# EAGLE design button (EAGLE 6.4)
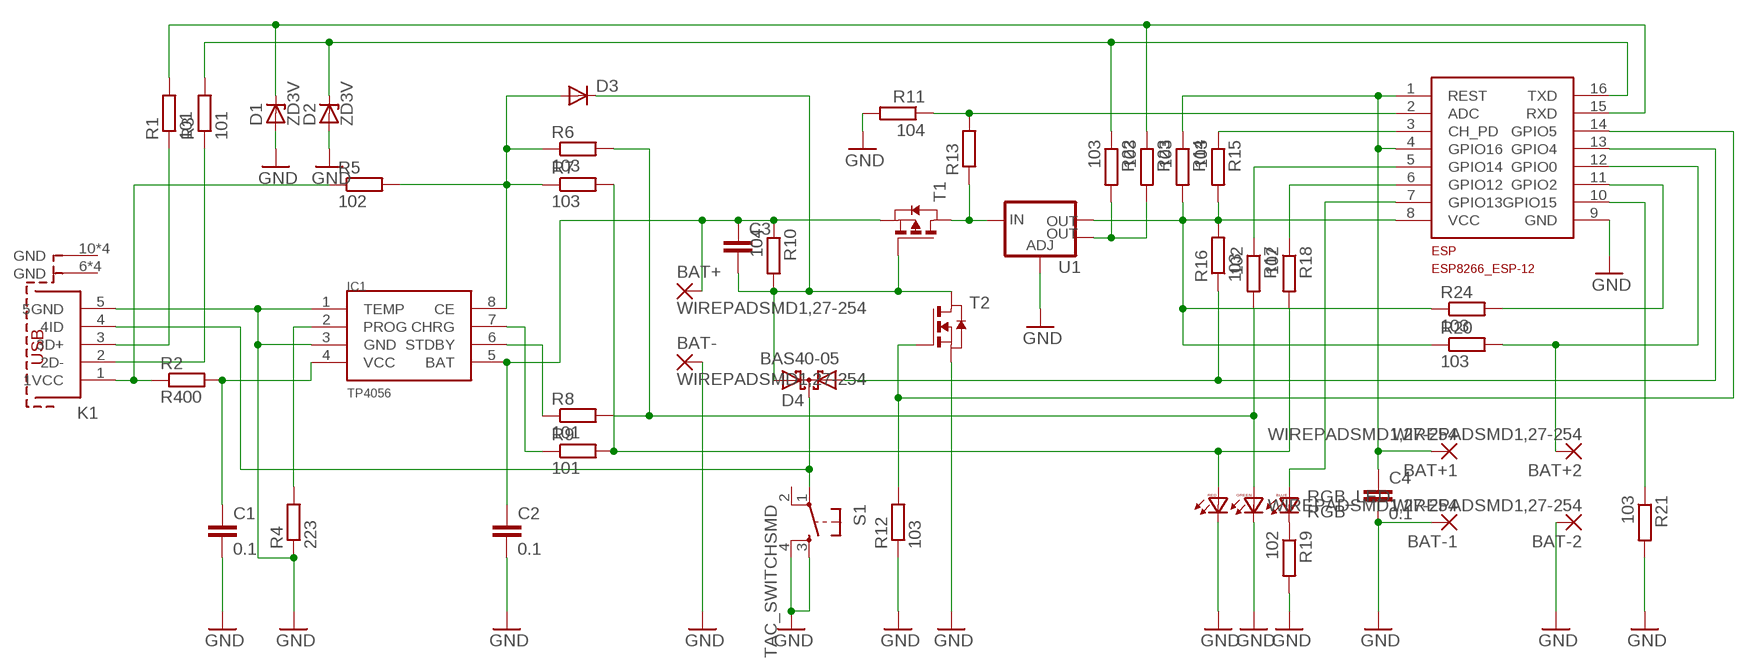
[diagram p0: schematic, sheet 1]

## Parts
BAT+  WIREPADSMD1,27-254  [SMD1,27-2,54]
BAT+1  WIREPADSMD1,27-254  [SMD1,27-2,54]
BAT+2  WIREPADSMD1,27-254  [SMD1,27-2,54]
BAT-  WIREPADSMD1,27-254  [SMD1,27-2,54]
BAT-1  WIREPADSMD1,27-254  [SMD1,27-2,54]
BAT-2  WIREPADSMD1,27-254  [SMD1,27-2,54]
C1  0.1  C-EUC1206K  [C1206K]
C2  0.1  C-EUC1206K  [C1206K]
C3  C-EUC1206K  [C1206K]
C4  0.1  C-EUC1206K  [C1206K]
D1  ZD3V  [SOD123]
D2  ZD3V  [SOD123]
D3  DIODE-SOD123  [SOD123]
D4  BAS40-05  [SOT23]
ESP  ESP8266_ESP-12GPIO04/05_CORRECTED  [ESP8266-ESP12]
IC1  TP4056  [SOP-8]
K1  629105150921  [629105150921]
R1  101  R-EU_R0603  [R0603]
R2  R400  R-EU_R1206  [R1206]
R3  101  R-EU_R0603  [R0603]
R4  223  R-EU_R0603  [R0603]
R5  102  R-EU_R0603  [R0603]
R6  103  R-EU_R0603  [R0603]
R7  103  R-EU_R0603  [R0603]
R8  101  R-EU_R0603  [R0603]
R9  101  R-EU_R0603  [R0603]
R10  104  R-EU_R0603  [R0603]
R11  104  R-EU_R0603  [R0603]
R12  103  R-EU_R0603  [R0603]
R13  R-EU_R0603  [R0603]
R14  103  R-EU_R0603  [R0603]
R15  103  R-EU_R0603  [R0603]
R16  103  R-EU_R0603  [R0603]
R17  102  R-EU_R0603  [R0603]
R18  102  R-EU_R0603  [R0603]
R19  102  R-EU_R0603  [R0603]
R20  103  R-EU_R0603  [R0603]
R21  103  R-EU_R0603  [R0603]
R22  103  R-EU_R0603  [R0603]
R23  103  R-EU_R0603  [R0603]
R24  103  R-EU_R0603  [R0603]
RGB_LED  RGB  [RGB]
S1  TAC_SWITCHSMD  [TACTILE-SWITCH-SMD]
T1  PMOSSOT23  [SOT-23]
T2  NMOSSOT23  [SOT-23]
U1  V_REG_LM1117SOT223  [SOT223]

## Nets
GND: BAT-1.1(P) BAT-2.1(P) BAT-.1(P) C1.2 C2.2 C4.2 D1.A D2.A ESP.9(GND) IC1.1(TEMP) IC1.3(GND) K1.5(5GND) R4.1 R11.2 R12.1 R19.2 R21.2 RGB_LED.5(RC) RGB_LED.6(GC) S1.3 S1.4 T2.2(S) U1.1(ADJ)
N$1: R13.1 T1.1(D) U1.3(IN)
N$2: C3.2 D3.C D4.2(A2) R10.2 T1.3(G) T2.1(D)
N$3: D4.1(A1) ESP.13(GPIO4) R16.1
N$4: BAT+.1(P) C2.1 C3.1 IC1.5(BAT) R10.1 T1.2(S)
N$5: ESP.14(GPIO5) R12.2 T2.3(G)
N$6: ESP.3(CH_PD) R15.1
N$7: BAT+1.1(P) C4.1 ESP.1(REST) ESP.4(GPIO16) R14.1
N$8: ESP.7(GPIO13) RGB_LED.3(BA)
N$9: R19.1 RGB_LED.4(BC)
N$10: BAT+2.1(P) ESP.12(GPIO0) R20.2
N$11: ESP.10(GPIO15) R21.1
N$12: ESP.8(VCC) R14.2 R15.2 R16.2 R20.1 R24.1 U1.2(OUT)
N$13: D4.3(C) K1.4(4ID) S1.1
N$14: ESP.6(GPIO12) R18.1
N$15: ESP.2(ADC) R11.1 R13.2
N$17: ESP.11(GPIO2) R24.2
N$18: ESP.5(GPIO14) R17.1
N$19: IC1.6(STDBY) R8.1
N$20: IC1.2(PROG) R4.2
N$21: C1.1 IC1.4(VCC) R2.2
N$22: K1.1(1VCC) R2.1 R5.1
N$23: IC1.7(CHRG) R9.1
N$25: K1.3(3D+) R1.1
N$26: K1.2(2D-) R3.1
N$27: D1.C ESP.15(RXD) R1.2 R23.1
N$28: D2.C ESP.16(TXD) R3.2 R22.1
N$29: R22.2 R23.2 U1.4(OUT)
N$30: R7.2 R9.2 R18.2 RGB_LED.2(RA)
N$31: R6.2 R8.2 R17.2 RGB_LED.1(GA)
N$32: D3.A IC1.8(CE) R5.2 R6.1 R7.1
Unconnected: K1.6(GND) K1.7(GND) K1.8(GND) K1.9(GND) K1.10(GND) K1.11(GND) K1.12(GND) K1.13(GND) S1.2

## Library data of the parts
BAT+ BAT+1 BAT+2 BAT- BAT-1 BAT-2 = wirepad:WIREPAD: Wire PAD connect wire on PCB
C1-C4 = resistor:C-EU: CAPACITOR, European symbol
D1 D2 = diode:ZD3V
D3 = diode:DIODE-: DIODE
D4 = diode:BAS40-05: Silicon Schottky Diodes General-purpose diode for high-speed switching
ESP = ESP8266-ESP12:ESP8266_ESP-12: Espressif ESP8266 ESP-12 Module with GPIO04 and GPIO05 corrected.
IC1 = TP4056:TP4056
K1 = Input-Output_Connectors_rev15d:629105150921: WR-COM_USB_Micro Type AB_Horizontal_SMT ; Micro Type AB Horizontal SMT - with Pegs - T&R Packaging Code : Con_I-O_COM_USB_2.0_AB_629105150921_629105150921 <http://katalog.we-online.de/media/images/eican/Con_I-O_COM_USB_2.0_AB_629105150921_pf2.jpg> Details see: http://katalog.we-online.de/em/datasheet/629105150921.pdf Created 12/08/2014, Dan Xu 2014 (C) Wurth Elektronik
R1-R24 = resistor:R-EU_: RESISTOR, European symbol
RGB_LED = led:RGB
S1 = SparkFun-Retired:TAC_SWITCH: Momentary Switch Button commonly used for reset or general input. Spark Fun Electronics SKU : COM-00097 SMT- SWCH-08247; PROD_ID: SWCH-08247
T1 = zetex:PMOSSOT23: MOS FET; OC_FARNELL: unknown; OC_NEWARK: unknown
T2 = zetex:NMOSSOT23: MOS FET; OC_FARNELL: unknown; OC_NEWARK: unknown
U1 = SparkFun-PowerIC:V_REG_LM1117: Voltage Regulator LM1117 Standard adjustable voltage regulator but in SMD form. Spark Fun Electronics SKU : COM-00595; PROD_ID: VREG-08170

## Board
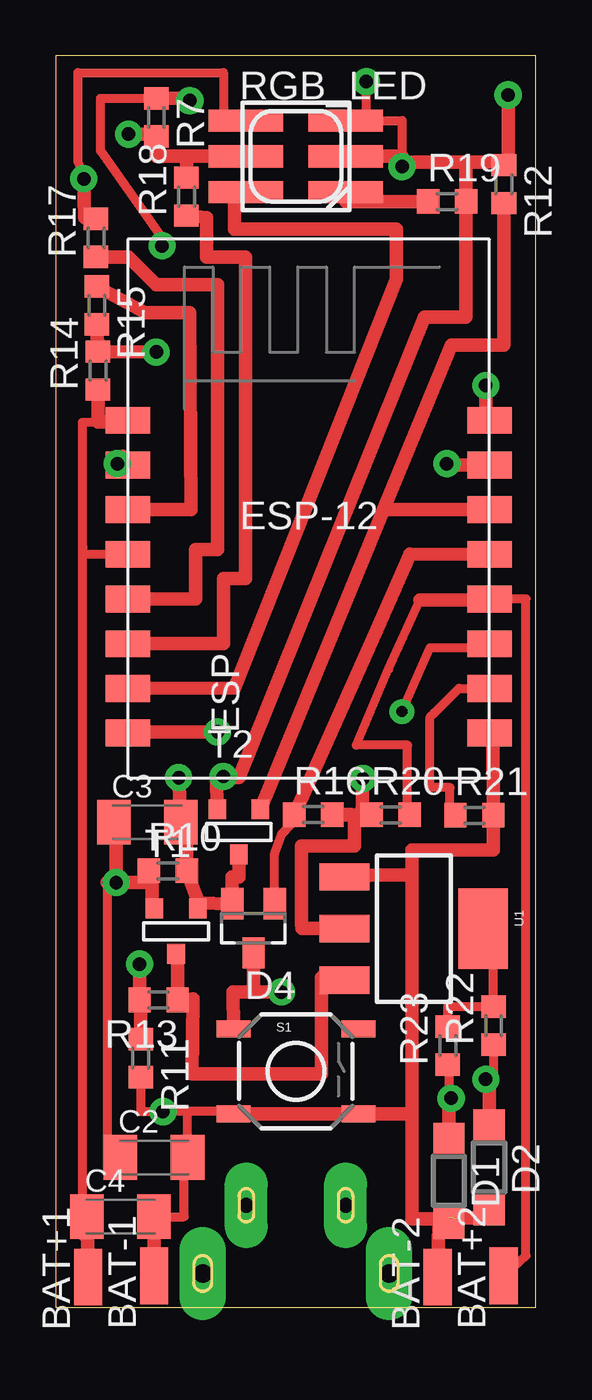
[diagram p1: board, top side]
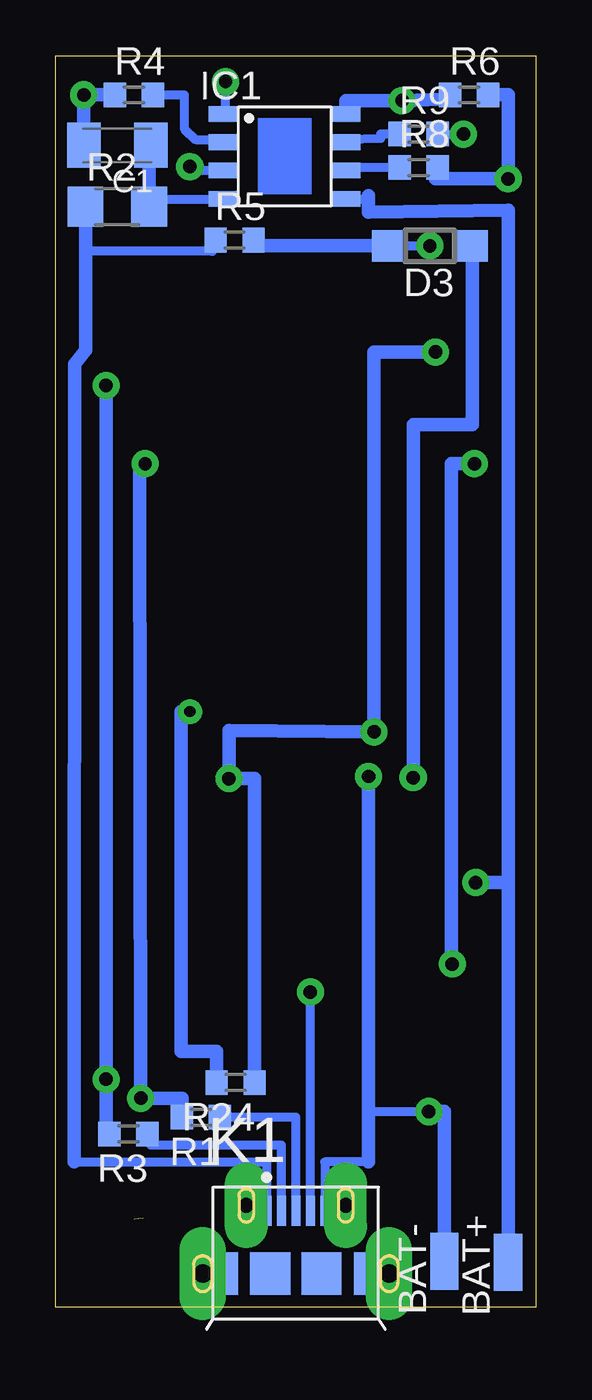
[diagram p2: board, bottom side, seen from below]

Size 21.5 x 56 mm. Coordinates in mm from the lower left corner, seen from the top.
Outline: 0,0 21.5,0 21.5,56 0,56 0,0
Copper layers (1*16): Top 0.035mm / dielectric 1.5mm / Bottom 0.035mm
Design rules "default": minimum track width 10mil, minimum drill 32mil, track to track 16mil, track to pad 16mil, pad to pad 16mil, via to via 16mil, smd to smd 16mil, copper to edge 40mil, drill to drill 40mil, minimum pad ring 25mil, minimum via ring 12mil, stop-mask expansion 4mil, vias tented up to drill 0mil, thermal gap 10mil

### Footprints (pad centres in the part's own frame; a part is rotated, then mirrored left to right if it is on the bottom)
SMD1,27-2,54 = smd 1.27 x 2.54: 1 0,0
C1206K = smd 1.5 x 2: 1 -1.5,0; 2 1.5,0
SOD123 = smd 1.4 x 1.4: A 1.9,0; C -1.9,0
SOT23 = smd 1 x 1.4: 1 -0.95,-1.1; 2 0.95,-1.1; 3 0,1.1
ESP8266-ESP12 = smd 2 x 1.2: 1 0,16; 2 0,14; 3 0,12; 4 0,10; 5 0,8; 6 0,6; 7 0,4; 8 0,2; 9 16.2,2; 10 16.2,4; 11 16.2,6; 12 16.2,8; 13 16.2,10; 14 16.2,12; 15 16.2,14; 16 16.2,16
SOP-8 = smd 1.3 x 0.7: 1 -2.75,1.905; 2 -2.75,0.635; 3 -2.75,-0.635; 4 -2.75,-1.905; 5 2.75,-1.905; 6 2.75,-0.635; 7 2.75,0.635; 8 2.75,1.905
629105150921 = smd 0.4 x 1.35: 1 -1.3,2.805; 2 -0.65,2.805; 3 0,2.805; 4 0.65,2.805; 5 1.3,2.805 | drill 0.65 pad 1 long: 6 -2.225,3.055; 7 2.225,3.055 | drill 0.82 pad 1.1 long: 8 -4.175,0; 9 4.175,0 | smd 2.185 x 1.9: 10 3.692,0; 13 -3.692,0 | smd 1.8 x 1.9: 11 1.15,0; 12 -1.15,0
R0603 = smd 1 x 1.1: 1 -0.85,0; 2 0.85,0
R1206 = smd 1.6 x 1.803: 1 -1.422,0; 2 1.422,0
RGB = smd 3.332 x 1: 1 -2.234,1.6; 2 -2.234,0; 3 -2.234,-1.6; 4 2.234,-1.6; 5 2.234,0; 6 2.234,1.6
TACTILE-SWITCH-SMD = smd 1.524 x 0.762: 1 -2.794,1.905; 2 2.794,1.905; 3 -2.794,-1.905; 4 2.794,-1.905
SOT-23 = smd 0.787 x 0.889: 1 0.025,-1.016; 2 -0.94,1.016; 3 0.991,1.016
SOT223 = smd 1.219 x 2.235: 1 -2.311,-3.099; 2 0,-3.099; 3 2.311,-3.099 | smd 3.6 x 2.2: 4 0,3.099

### Placement (x,y rotation side)
BAT+  1.25,2 0 bottom
BAT+1  1.45,1.35 0 top
BAT+2  20.05,1.4 0 top
BAT-  4.1,2.05 0 bottom
BAT-1  4.4,1.4 0 top
BAT-2  17.1,1.35 0 top
C1  18.75,52 180 bottom
C2  4.4,6.7 0 top
C3  4.1,21.7 0 top
C4  2.9,4.05 0 top
D1  17.6,5.65 270 top
D2  19.4,6.25 270 top
D3  4.75,47.5 180 bottom
D4  8.85,16.95 180 top
ESP  3.22,23.69 0 top
IC1  11.25,51.5 0 bottom
K1  10.75,1.5 0 bottom
R1  15,8.5 180 bottom
R2  18.75,49.25 0 bottom
R3  18.25,7.75 180 bottom
R4  18,54.25 0 bottom
R5  13.5,47.75 0 bottom
R6  3,54.25 0 bottom
R7  4.5,53.25 270 top
R8  5.25,51 0 bottom
R9  5.25,52.5 0 bottom
R10  5.01,19.53 0 top
R11  3.8,11.15 270 top
R12  20.06,50.26 270 top
R13  4.6,13.75 180 top
R14  1.89,41.91 90 top
R15  1.84,44.83 270 top
R16  11.53,22.04 0 top
R17  1.8,47.85 90 top
R18  5.85,49.7 90 top
R19  17.52,49.48 0 top
R20  15,22.03 0 top
R21  18.74,22.01 0 top
R22  19.6,12.6 90 top
R23  17.55,11.7 90 top
R24  13.45,10.05 180 bottom
RGB_LED  10.75,51.5 0 top
S1  10.75,10.55 0 top
T1  5.36,16.82 0 top
T2  8.17,21.27 0 top
U1  16.03,16.94 270 top

### Tracks (layer width: path | path; a pad name or v marks a point on that pad's centre or on a via)
GND  (via drill 0.6)  (1 unrouted)
  Top 0.406: 13.75,51.6 13.75,51.5 RGB_LED.5 12.98,51.78 14.17,51.78 | 15.5,51.5 v15.5,51.05 15.5,53.1 RGB_LED.6 13.9,53.1 v13.9,54.85 | 19.3,51.25 18.75,51.3 | C4.2 5.75,4.05 5.75,6.15 C2.2 5.9,8.75 | R11.2 3.8,8.75 v4.8,8.75 5.9,8.75 | S1.3 8.06,8.75 5.9,8.75
  Top 0.61: 15.95,8.64 S1.4 S1.3 | U1.1 14.45,19.35 15.95,19.35 | 15.95,19.35 15.95,20.45 17.4,20.45 19.59,20.45 R21.2 19.57,25.71 19.65,25.65 19.61,25.69 ESP.9 | v15.5,51.05 15.55,51.05 15.75,51.25 18.35,51.25 | D2.A 19.4,4 17.6,4 D1.A | 18,3.95 17.15,3.95 | 17.15,3.95 15.95,3.95 15.95,8.64 | 20.25,51.3 19.87,51.3 arc-90 R12.1 | T2.2 7.2,23.74 v7.5,23.75 7.5,23.7 8.2,23.7 16.5,44.3 18.37,44.3 R19.2 18.35,51.25 | v20.25,54.25 20.25,51.3 | 13.75,51.5 15.5,51.5 | 18.35,51.25 19,51.25 | 19,51.25 19.3,51.25 | 15.95,8.64 15.95,19.35 | 20.25,51.3 19,51.25 | BAT-1.1 C4.2 | BAT-2.1 17.15,3.95
  Bottom 0.406: K1.5 9.45,6.5 7.5,6.5 7.5,8.75 v4.8,8.75 | IC1.3 15.75,50.87 v15.5,51.05 | IC1.1 13.9,53.4 v13.9,54.85
  Bottom 0.61: R4.1 v20.25,54.25 C1.2 | 4,2.05 BAT-.1 4.1,8.75 v4.8,8.75 | v7.5,23.75 7.5,6.5
N$1
  Top 0.406: T1.1 5.45,15.6 | 6.13,13.8 5.85,13.8
  Top 0.61: 6.13,13.8 6.1,10.45 11.9,10.45 11.9,14.75 U1.3 | 5.45,15.6 R13.1 5.85,13.8
N$2  (via drill 0.6)
  Top 0.406: T1.3 6.41,18.04
  Top 0.61: 6.41,18.04 R10.2 5.86,21.45 C3.2 v5.5,23.7 | T2.1 8.2,19.25 7.9,19.25 D4.2 6.35,18.09 T1.3
  Bottom 0.61: D3.C 2.85,39.5 5.5,39.5 v5.5,23.7
N$3
  Top 0.406: D4.1 9.8,20.3 10.1,21.15 10.95,22.04 R16.1
  Top 0.61: R16.1 14.29,30.13 15.85,33.68 15.85,33.7 ESP.13
N$4  (via drill 0.6)
  Top 0.406: T1.2 4.31,18.24 | 2.3,19 2.3,6.15 C2.1
  Top 0.61: 4.31,18.24 4.31,19 | 4.31,19 R10.1 | C3.1 2.7,21.3 v2.7,19 | v2.7,19 4.31,19 | 2.3,19 v2.7,19
  Bottom 0.406: IC1.5 7.5,49.59 7.5,49.75
  Bottom 0.61: 1.25,19 1.25,49.09 7.5,49 7.5,49.75 | 1.25,19 v2.7,19 | BAT+.1 1.25,19
N$5
  Top 0.406: 19.33,36.1 ESP.14 | 14.68,35.67 14.68,35.69 | 20.05,43.06 17.7,43.06
  Top 0.61: 14.68,35.67 T2.3 | R12.2 20.05,48.11 20.05,43.06 17.86,43.06 | ESP.14 14.68,35.69 17.7,43.06
N$6
  Top 0.61: ESP.3 5,35.69 5.2,35.7 6.05,35.7 6,44.5 4,44.5 R15.1 1.84,45.75
N$7
  Top 0.406: ESP.4 1.24,33.69 1.2,34.2 | 1.2,34.2 1.2,39.6 1.89,39.6 | 3.13,39.6 ESP.1 | C4.1 1.2,3.15 1.2,34.2
  Top 0.61: 3.13,39.6 1.89,39.6 R14.1 | BAT+1.1 C4.1
N$8
  Top 0.406: 8,50 RGB_LED.3
  Top 0.61: 8,50 8,48.25 15.25,48.25 15.25,46 8,27.7 ESP.7
N$9
  Top 0.406: 12.98,49.48 RGB_LED.4
  Top 0.61: R19.1 12.98,49.48
N$10
  Top 0.406: R20.2 15.75,22.08 15.75,25.15 13.45,25.15 14.9,28.55 16.3,31.65 | 19.48,31.65 ESP.12 21.05,31.7 21.05,2.3 BAT+2.1
  Top 0.61: 16.3,31.65 19.48,31.65
N$11
  Top 0.406: R21.1 17.64,22.15 17.65,23.25 16.75,23.25 16.75,26.4 16.95,26.6 18.05,27.69 ESP.10
N$12  (via drill 0.6)
  Top 0.61: U1.2 11.02,16.95 11,17.15 11,20.65 13.38,20.65 13.38,21.88 | 13.38,21.88 13.5,22 13.12,22.05 R20.1 | 13.38,21.88 13.21,22.04 R16.2 13.7,21.99 v13.75,23.65 | R15.2 1.84,43.51 R14.2 1.99,42.76 v4.5,42.75 | ESP.8 3.22,25.75 v7.25,25.75
  Bottom 0.61: v4.5,42.75 7.25,42.75 v7.25,25.75 13.75,25.8 v13.75,23.65 12.6,23.65 R24.1
N$13  (via drill 0.6)
  Top 0.61: D4.3 8.86,14.1 7.93,14.1 | 7.93,14.1 S1.1 | v10.1,14.1 7.93,14.1
  Bottom 0.406: K1.4 v10.1,14.1
N$14
  Top 0.61: ESP.6 7.5,29.7 7.5,32.6 8.5,32.6 8.5,47 6.75,47 6.75,48.75 R18.1
N$15  (via drill 0.6)
  Top 0.406: ESP.2 3,38.19 v2.75,37.75 | v3.75,15.35 3.75,14.9
  Top 0.61: 3.75,14.9 R13.2 3.8,13.45 R11.1
  Bottom 0.61: v2.75,37.75 3.8,37.75 3.8,16 v3.75,15.35
N$17  (via drill 0.5)
  Top 0.406: ESP.11 19.42,29.5 16.75,29.5 v15.5,26.65
  Bottom 0.61: R24.2 14.3,11.45 15.9,11.45 15.9,26.65 v15.5,26.65
N$18
  Top 0.61: ESP.5 6.25,31.69 6.25,33.9 7.25,33.9 7.25,45.75 4.5,45.75 3.25,47 R17.1
N$19
  Bottom 0.406: R8.1 8.5,51 IC1.6
N$20
  Bottom 0.406: R4.2 15.75,54.25 15.75,52.75 15.25,52.25 14,52.25 IC1.2
N$21
  Bottom 0.406: R2.2 17.58,49.59 IC1.4
  Bottom 0.61: R2.2 17.33,51.92 C1.1
N$22
  Bottom 0.406: 20.67,6.5 12.05,6.5 K1.1 | R5.1 14.5,47.75 14.5,47.25 20.17,47.25
  Bottom 0.61: R2.1 20.17,47.25 20.17,42.83 20.65,42.2 20.67,6.5
N$23
  Bottom 0.406: R9.1 6.95,52.5 6.95,52.3 8.5,52.25 IC1.7
N$25
  Bottom 0.406: K1.3 10.75,8.5 R1.1
N$26
  Bottom 0.406: K1.2 11.4,7.25 17.25,7.25 17.4,7.65 R3.1
N$27  (via drill 0.6)
  Top 0.406: v17.5,37.75 17.75,37.69 | R23.1 17.6,10.85 17.6,9.35 v17.7,9.35
  Top 0.61: 17.75,37.69 ESP.15 | D1.C 17.6,9.3 v17.7,9.35
  Bottom 0.61: v17.5,37.75 17.75,37.75 v17.7,9.35 15.85,9.35 R1.2
N$28  (via drill 0.6)
  Top 0.406: 19.25,40.19 ESP.16 | R22.1 19.6,10.15 v19.25,10.2
  Top 0.61: v19.25,41.25 19.25,40.19 | D2.C 19.4,10.2 v19.25,10.2
  Bottom 0.406: R3.2 19.25,7.5
  Bottom 0.61: v19.25,41.25 v19.25,10.2 19.25,7.5
N$29
  Top 0.406: R23.2 17.55,13.45 R22.2 19.6,16.99 U1.4
N$30  (via drill 0.6)
  Top 0.61: v3.25,52.5 4.15,52.5 R7.2 4.5,51.5 5.85,51.5 | 5.85,51.5 RGB_LED.2 | R18.2 5.85,51.5
  Bottom 0.406: R9.2 v3.25,52.5
N$31  (via drill 0.6)
  Top 0.406: v1.25,50.5 1.25,50.75 1,51.25 1,55.25 7.5,55.25 7.5,53.25 RGB_LED.1
  Top 0.61: v1.25,50.5 1.3,48.75 R17.2
  Bottom 0.61: R6.2 1.25,54.25 v1.25,50.5 4.5,50.5 R8.2
N$32  (via drill 0.6)
  Top 0.406: v4.75,47.5 5,47.5 2,51.75 2,54.1 R7.1
  Top 0.61: R7.1 6,54.1 v6,54
  Bottom 0.406: D3.A v4.75,47.5
  Bottom 0.61: IC1.8 8.5,54 v6,54 4.2,54.05 3.85,54.05 R6.1 | R5.2 12.65,47.5 D3.A